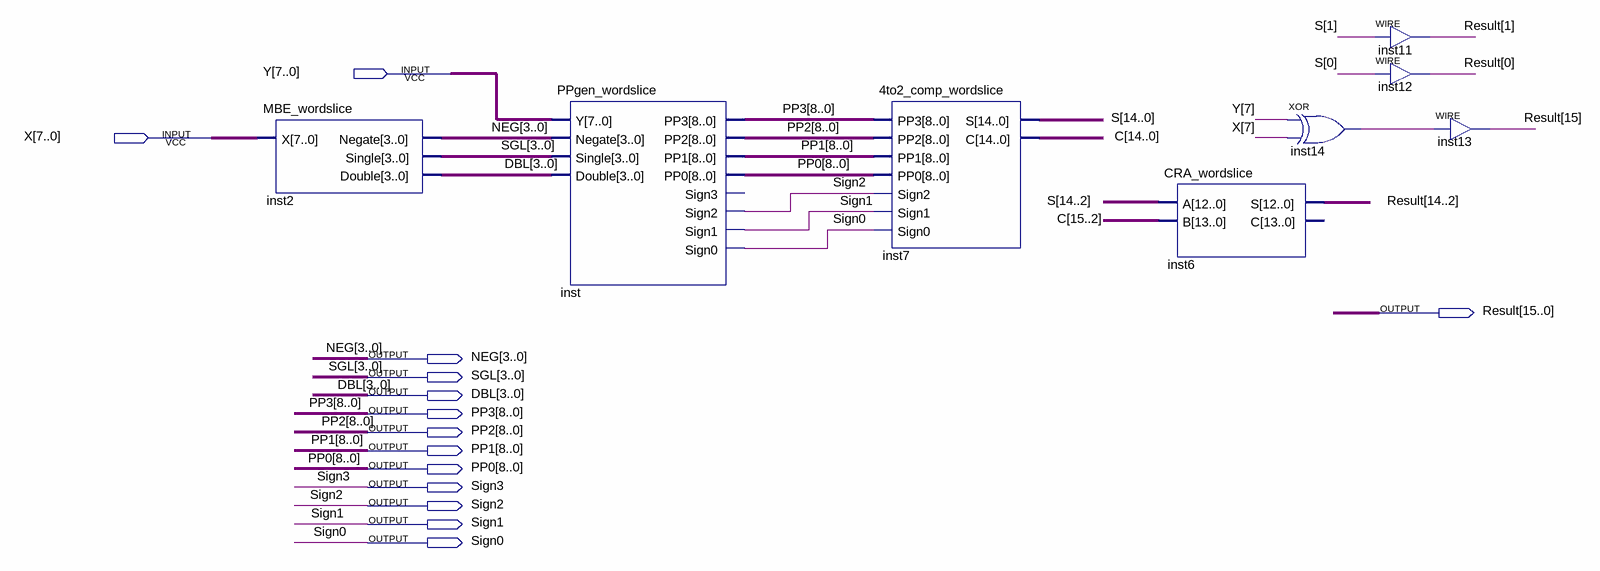
[diagram p0: schematic sheet]
// Quartus schematic BoothMultiplier8x8.bdf as structural Verilog: 8 symbols, 14 pins
module BoothMultiplier8x8 (
  input  [7:0] Y,
  input  [7:0] X,
  output [15:0] Result,
  output [3:0] NEG,
  output [3:0] SGL,
  output [3:0] DBL,
  output [8:0] PP3,
  output [8:0] PP2,
  output [8:0] PP1,
  output [8:0] PP0,
  output Sign3,
  output Sign2,
  output Sign1,
  output Sign0
);

  wire inst14_out;
  wire [14:0] S;
  wire [15:0] C;

  MBE_wordslice inst2 (.X(X), .Negate(NEG), .Single(SGL), .Double(DBL));
  PPgen_wordslice inst (
    .Y(Y), .Negate(NEG), .Single(SGL), .Double(DBL), .PP3(PP3), .PP2(PP2), .PP1(PP1), .PP0(PP0),
    .Sign2(Sign2), .Sign1(Sign1), .Sign0(Sign0));  // open: Sign3
  \4to2_comp_wordslice  inst7 (
    .PP3(PP3), .PP2(PP2), .PP1(PP1), .PP0(PP0), .Sign2(Sign2), .Sign1(Sign1), .Sign0(Sign0), .S(S),
    .C(C[14:0]));
  CRA_wordslice inst6 (.A(S[14:2]), .B(C[15:2]), .S(Result[14:2]));  // open: C
  xor inst14 (inst14_out, Y[7], X[7]);
  assign Result[1] = S[1];  // WIRE inst11
  assign Result[0] = S[0];  // WIRE inst12
  assign Result[15] = inst14_out;  // WIRE inst13
endmodule
